# EAGLE design v2 (EAGLE 9.6.2)
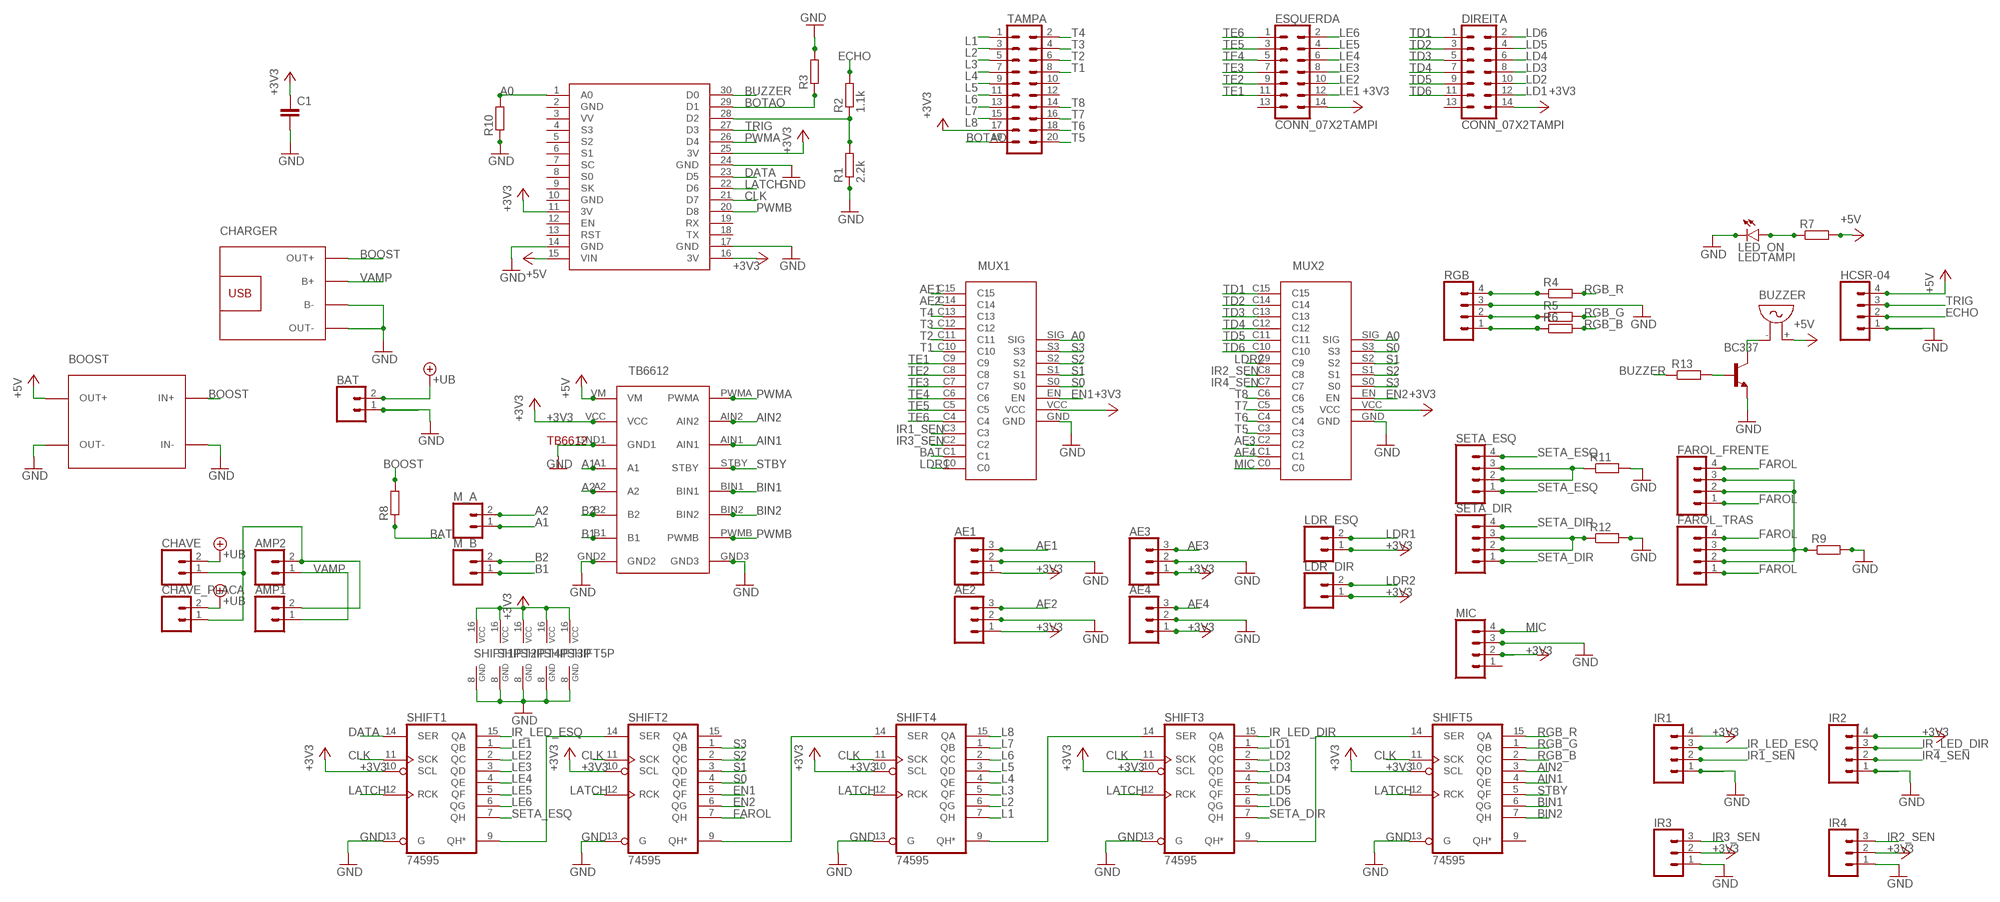
[diagram p0: schematic, sheet 1]

## Parts
AE1  CONN_03TAMPI  [TAMPI_1X03]
AE2  CONN_03TAMPI  [TAMPI_1X03]
AE3  CONN_03TAMPI  [TAMPI_1X03]
AE4  CONN_03TAMPI  [TAMPI_1X03]
AMP1  CONN_02TAMPI  [TAMPI_1X02]
AMP2  CONN_02TAMPI  [TAMPI_1X02]
BAT  CONN_02TAMPI  [TAMPI_1X02]
BC337  BC337  [TAMPI_BC337]
BOOST  MT3608TAMPI  [TAMPI_MT3608]
BUZZER  BUZZERTAMPI  [TAMPI_BUZZER]
C1  CAPACITORTAMPI  [TAMPI_C2.5-3]
CHARGER  TP4056TAMPI  [TAMPI_TP4056]
CHAVE  CONN_02TAMPI  [TAMPI_1X02]
CHAVE_PLACA  CONN_02TAMPI  [TAMPI_1X02]
DIREITA  CONN_07X2TAMPI  [TAMPI_2X7]
ESQUERDA  CONN_07X2TAMPI  [TAMPI_2X7]
FAROL_FRENTE  CONN_04  [TAMPI_1X04]
FAROL_TRAS  CONN_04  [TAMPI_1X04]
HCSR-04  CONN_04  [TAMPI_1X04]
IR1  CONN_04  [TAMPI_1X04]
IR2  CONN_04  [TAMPI_1X04]
IR3  CONN_03TAMPI  [TAMPI_1X03]
IR4  CONN_03TAMPI  [TAMPI_1X03]
LDR_DIR  CONN_02TAMPI  [TAMPI_1X02]
LDR_ESQ  CONN_02TAMPI  [TAMPI_1X02]
LED_ON  LEDTAMPI  [TAMPI_LED3MM]
M_A  CONN_02TAMPI  [TAMPI_1X02]
M_B  CONN_02TAMPI  [TAMPI_1X02]
MIC  CONN_04  [TAMPI_1X04]
MUX1  4067TAMPI  [TAMPI_4067]
MUX2  4067TAMPI  [TAMPI_4067]
R1  2.2k  RESISTOR  [TAMPI_RES]
R2  1.1k  RESISTOR  [TAMPI_RES]
R3  RESISTOR  [TAMPI_RES]
R4  RESISTOR  [TAMPI_RES]
R5  RESISTOR  [TAMPI_RES]
R6  RESISTOR  [TAMPI_RES]
R7  RESISTOR  [TAMPI_RES]
R8  RESISTOR  [TAMPI_RES]
R9  RESISTOR  [TAMPI_RES]
R10  RESISTOR  [TAMPI_RES]
R11  RESISTOR  [TAMPI_RES]
R12  RESISTOR  [TAMPI_RES]
R13  RESISTOR  [TAMPI_RES]
RGB  CONN_04  [TAMPI_1X04]
SETA_DIR  CONN_04  [TAMPI_1X04]
SETA_ESQ  CONN_04  [TAMPI_1X04]
SHIFT1  74595  [TAMPI_74595]
SHIFT2  74595  [TAMPI_74595]
SHIFT3  74595  [TAMPI_74595]
SHIFT4  74595  [TAMPI_74595]
SHIFT5  74595  [TAMPI_74595]
TAMPA  CONN_10X2TAMPI  [TAMPI_2X10]
TB6612  TB6612FNGTAMPI  [TAMPI_TB6612]
U$1  NODEMCUTAMPI  [TAMPI_NODEMCU]

## Nets
+3V3: AE1.1 AE2.1 AE3.1 AE4.1 C1.1 DIREITA.14 ESQUERDA.14 IR1.4 IR2.4 IR3.2 IR4.2 LDR_DIR.1 LDR_ESQ.1 MIC.2 MUX1.VCC MUX2.VCC SHIFT1.10(SCL) SHIFT1.16(VCC) SHIFT2.10(SCL) SHIFT2.16(VCC) SHIFT3.10(SCL) SHIFT3.16(VCC) SHIFT4.10(SCL) SHIFT4.16(VCC) SHIFT5.10(SCL) SHIFT5.16(VCC) TAMPA.17 TB6612.VCC U$1.11(3V) U$1.16(3V) U$1.25(3V)
+5V: BOOST.OUT+ BUZZER.+ HCSR-04.4 R7.2 TB6612.VM U$1.15(VIN)
+UB [bat power]: BAT.2 CHAVE.2 CHAVE_PLACA.2
A0: MUX1.SIG MUX2.SIG R10.2 U$1.1(A0)
A1: M_A.1 TB6612.A1
A2: M_A.2 TB6612.A2
AE1: AE1.3 MUX1.C15
AE2: AE2.3 MUX1.C14
AE3: AE3.3 MUX2.C2
AE4: AE4.3 MUX2.C1
AIN1: SHIFT5.4(QE) TB6612.AIN1
AIN2: SHIFT5.3(QD) TB6612.AIN2
B1: M_B.1 TB6612.B1
B2: M_B.2 TB6612.B2
BAT: MUX1.C1 R8.1
BIN1: SHIFT5.6(QG) TB6612.BIN1
BIN2: SHIFT5.7(QH) TB6612.BIN2
BOOST [bat power]: BOOST.IN+ CHARGER.OUT+ R8.2
BOTAO: R3.1 TAMPA.19 U$1.29(D1)
BUZZER: R13.1 U$1.30(D0)
CLK: SHIFT1.11(SCK) SHIFT2.11(SCK) SHIFT3.11(SCK) SHIFT4.11(SCK) SHIFT5.11(SCK) U$1.21(D7)
DATA: SHIFT1.14(SER) U$1.23(D5)
ECHO: HCSR-04.2 R2.2
EN1: MUX1.EN SHIFT2.5(QF)
EN2: MUX2.EN SHIFT2.6(QG)
FAROL: FAROL_FRENTE.1 FAROL_FRENTE.4 FAROL_TRAS.1 FAROL_TRAS.4 SHIFT2.7(QH)
GND: AE1.2 AE2.2 AE3.2 AE4.2 BAT.1 BC337.1(E) BOOST.IN- BOOST.OUT- C1.2 CHARGER.B- CHARGER.OUT- HCSR-04.1 IR1.1 IR2.1 IR3.1 IR4.1 LED_ON.K(C) MIC.3 MUX1.GND MUX2.GND R1.1 R3.2 R9.2 R10.1 R11.2 R12.2 RGB.3 SHIFT1.8(GND) SHIFT1.13(G) SHIFT2.8(GND) SHIFT2.13(G) SHIFT3.8(GND) SHIFT3.13(G) SHIFT4.8(GND) SHIFT4.13(G) SHIFT5.8(GND) SHIFT5.13(G) TB6612.GND1 TB6612.GND2 TB6612.GND3 U$1.14(GND) U$1.17(GND) U$1.24(GND)
IR1_SEN: IR1.2 MUX1.C3
IR2_SEN: IR4.3 MUX2.C8
IR3_SEN: IR3.3 MUX1.C2
IR4_SEN: IR2.2 MUX2.C7
IR_LED_DIR: IR2.3 SHIFT3.15(QA)
IR_LED_ESQ: IR1.3 SHIFT1.15(QA)
L1: SHIFT4.7(QH) TAMPA.1
L2: SHIFT4.6(QG) TAMPA.3
L3: SHIFT4.5(QF) TAMPA.5
L4: SHIFT4.4(QE) TAMPA.7
L5: SHIFT4.3(QD) TAMPA.9
L6: SHIFT4.2(QC) TAMPA.11
L7: SHIFT4.1(QB) TAMPA.13
L8: SHIFT4.15(QA) TAMPA.15
LATCH: SHIFT1.12(RCK) SHIFT2.12(RCK) SHIFT3.12(RCK) SHIFT4.12(RCK) SHIFT5.12(RCK) U$1.22(D6)
LD1: DIREITA.12 SHIFT3.1(QB)
LD2: DIREITA.10 SHIFT3.2(QC)
LD3: DIREITA.8 SHIFT3.3(QD)
LD4: DIREITA.6 SHIFT3.4(QE)
LD5: DIREITA.4 SHIFT3.5(QF)
LD6: DIREITA.2 SHIFT3.6(QG)
LDR1: LDR_ESQ.2 MUX1.C0
LDR2: LDR_DIR.2 MUX2.C9
LE1: ESQUERDA.12 SHIFT1.1(QB)
LE2: ESQUERDA.10 SHIFT1.2(QC)
LE3: ESQUERDA.8 SHIFT1.3(QD)
LE4: ESQUERDA.6 SHIFT1.4(QE)
LE5: ESQUERDA.4 SHIFT1.5(QF)
LE6: ESQUERDA.2 SHIFT1.6(QG)
MIC: MIC.4 MUX2.C0
N$1: R4.1 RGB.4
N$2: R5.1 RGB.2
N$3: R6.1 RGB.1
N$4: R11.1 SETA_ESQ.2 SETA_ESQ.3
N$5: SHIFT1.9(QH*) SHIFT2.14(SER)
N$6: FAROL_FRENTE.2 FAROL_FRENTE.3 FAROL_TRAS.2 FAROL_TRAS.3 R9.1
N$7: R12.1 SETA_DIR.2 SETA_DIR.3
N$8 [bat power]: AMP1.2 AMP2.2 CHAVE.1 CHAVE_PLACA.1
N$9: BC337.2(B) R13.2
N$10: BC337.3(C) BUZZER.-
N$28: LED_ON.A R7.1
N$29: SHIFT3.9(QH*) SHIFT5.14(SER)
N$30: SHIFT3.14(SER) SHIFT4.9(QH*)
N$31: SHIFT2.9(QH*) SHIFT4.14(SER)
N$39: R1.2 R2.1 U$1.28(D2)
PWMA: TB6612.PWMA U$1.26(D4)
PWMB: TB6612.PWMB U$1.20(D8)
RGB_B: R6.2 SHIFT5.2(QC)
RGB_G: R5.2 SHIFT5.1(QB)
RGB_R: R4.2 SHIFT5.15(QA)
S0: MUX1.S0 MUX2.S3 SHIFT2.4(QE)
S1: MUX1.S1 MUX2.S2 SHIFT2.3(QD)
S2: MUX1.S2 MUX2.S1 SHIFT2.2(QC)
S3: MUX1.S3 MUX2.S0 SHIFT2.1(QB)
SETA_DIR: SETA_DIR.1 SETA_DIR.4 SHIFT3.7(QH)
SETA_ESQ: SETA_ESQ.1 SETA_ESQ.4 SHIFT1.7(QH)
STBY: SHIFT5.5(QF) TB6612.STBY
T1: MUX1.C10 TAMPA.8
T2: MUX1.C11 TAMPA.6
T3: MUX1.C12 TAMPA.4
T4: MUX1.C13 TAMPA.2
T5: MUX2.C3 TAMPA.20
T6: MUX2.C4 TAMPA.18
T7: MUX2.C5 TAMPA.16
T8: MUX2.C6 TAMPA.14
TD1: DIREITA.1 MUX2.C15
TD2: DIREITA.3 MUX2.C14
TD3: DIREITA.5 MUX2.C13
TD4: DIREITA.7 MUX2.C12
TD5: DIREITA.9 MUX2.C11
TD6: DIREITA.11 MUX2.C10
TE1: ESQUERDA.11 MUX1.C9
TE2: ESQUERDA.9 MUX1.C8
TE3: ESQUERDA.7 MUX1.C7
TE4: ESQUERDA.5 MUX1.C6
TE5: ESQUERDA.3 MUX1.C5
TE6: ESQUERDA.1 MUX1.C4
TRIG: HCSR-04.3 U$1.27(D3)
VAMP [bat power]: AMP1.1 AMP2.1 CHARGER.B+
Unconnected: DIREITA.13 ESQUERDA.13 MIC.1 SHIFT2.15(QA) SHIFT5.9(QH*) TAMPA.10 TAMPA.12 U$1.3(VV) U$1.4(S3) U$1.5(S2) U$1.6(S1) U$1.7(SC) U$1.8(S0) U$1.9(SK) U$1.12(EN) U$1.13(RST) U$1.18(TX) U$1.19(RX)

## Power pins joined to a net without a drawn wire
GND: U$1.2(GND) U$1.10(GND)

## Library data of the parts
AE1-AE4 IR3 IR4 = tampi:CONN_03: Multi connection point. Often used as Generic Header-pin footprint for 0.1 inch spaced/style header connections On any of the 0.1 inch spaced packages, you can populate with these: Break Away Headers - Straight <https://www.sparkfun.com/products/116> (PRT-00116) Break Away Male Headers - Right Angle <https://www.sparkfun.com/products/553> (PRT-00553) Female Headers <https://www.sparkfun.com/products/115> (PRT-00115) Break Away Headers - Machine Pin <https://www.sparkfun.com/products/117> (PRT-00117) Break Away Female Headers - Swiss Machine Pin <https://www.sparkfun.com/products/743> (PRT-00743) Stackable Header - 3 Pin (Female, 0.1") <https://www.sparkfun.com/products/13875> (PRT-13875) For SCREWTERMINALS and SPRING TERMINALS visit here: Screw Terimnals on SparkFun.com <https://www.sparkfun.com/search/results?term=Screw+Terminals> (5mm/3.5mm/2.54mm spacing) This device is also useful as a general connection point to wire up your design to another part of your project. Our various solder wires solder well into these plated through hole pads. Hook-Up Wire - Assortment (Stranded, 22 AWG) <https://www.sparkfun.com/products/11375> (PRT-11375) Hook-Up Wire - Assortment (Solid Core, 22 AWG) <https://www.sparkfun.com/products/11367> (PRT-11367) View the entire wire category on our website here <https://www.sparkfun.com/categories/141> Special notes: Molex polarized connector foot print use with SKU : PRT-08232 with associated crimp pins and housings.
AMP1 AMP2 BAT CHAVE CHAVE_PLACA LDR_DIR LDR_ESQ M_A M_B = tampi:CONN_02: Multi connection point. Often used as Generic Header-pin footprint for 0.1 inch spaced/style header connections On any of the 0.1 inch spaced packages, you can populate with these: Break Away Headers - Straight <https://www.sparkfun.com/products/116> (PRT-00116) Break Away Male Headers - Right Angle <https://www.sparkfun.com/products/553> (PRT-00553) Female Headers <https://www.sparkfun.com/products/115> (PRT-00115) Break Away Headers - Machine Pin <https://www.sparkfun.com/products/117> (PRT-00117) Break Away Female Headers - Swiss Machine Pin <https://www.sparkfun.com/products/743> (PRT-00743) For SCREWTERMINALS and SPRING TERMINALS visit here: Screw Terimnals on SparkFun.com <https://www.sparkfun.com/search/results?term=Screw+Terminals> (5mm/3.5mm/2.54mm spacing) This device is also useful as a general connection point to wire up your design to another part of your project. Our various solder wires solder well into these plated through hole pads. Hook-Up Wire - Assortment (Stranded, 22 AWG) <https://www.sparkfun.com/products/11375> (PRT-11375) Hook-Up Wire - Assortment (Solid Core, 22 AWG) <https://www.sparkfun.com/products/11367> (PRT-11367) View the entire wire category on our website here <https://www.sparkfun.com/categories/141> Special notes: Molex polarized connector foot print use with: PRT-08233 with associated crimp pins and housings. 2.54_SCREWTERM for use with PRT-10571. 3.5mm Screw Terminal footprints for PRT-08084 5mm Screw Terminal footprints for use with PRT-08432
BC337 = tampi:BC337: NPN Transistor
BOOST = tampi:MT3608: DC/DC Step-Up Regulator based on MT3608 chip MT3608 datasheet available here: https://www.olimex.com/Products/Breadboarding/BB-PWR-3608/resources/MT3608.pdf Click here to find device on ebay.com <http://www.ebay.com/sch/mt3608+module>
BUZZER = tampi:BUZZER: BUZZER Source: Buerklin; OC_FARNELL: unknown; OC_NEWARK: unknown
C1 = tampi:CAPACITOR: CAPACITOR naming: grid - package width
CHARGER = tampi:TP4056: Lithium Battery 5V Charger with protection circuit More details available here: http://www.instructables.com/id/DIY-Lithium-ion-Battery-Charger/step4/TP4056-based-lithium-ion-battery-charger-module/ Click here to find device on ebay.com <http://www.ebay.com/sch/tp4056+charger+usb+protection>
DIREITA ESQUERDA = tampi:CONN_07X2
FAROL_FRENTE FAROL_TRAS HCSR-04 IR1 IR2 MIC RGB SETA_DIR SETA_ESQ = tampi:CONN_04: Multi connection point. Often used as Generic Header-pin footprint for 0.1 inch spaced/style header connections On any of the 0.1 inch spaced packages, you can populate with these: Break Away Headers - Straight <https://www.sparkfun.com/products/116> (PRT-00116) Break Away Male Headers - Right Angle <https://www.sparkfun.com/products/553> (PRT-00553) Female Headers <https://www.sparkfun.com/products/115> (PRT-00115) Break Away Headers - Machine Pin <https://www.sparkfun.com/products/117> (PRT-00117) Break Away Female Headers - Swiss Machine Pin <https://www.sparkfun.com/products/743> (PRT-00743) For SCREWTERMINALS and SPRING TERMINALS visit here: Screw Terimnals on SparkFun.com <https://www.sparkfun.com/search/results?term=Screw+Terminals> (5mm/3.5mm/2.54mm spacing) This device is also useful as a general connection point to wire up your design to another part of your project. Our various solder wires solder well into these plated through hole pads. Hook-Up Wire - Assortment (Stranded, 22 AWG) <https://www.sparkfun.com/products/11375> (PRT-11375) Hook-Up Wire - Assortment (Solid Core, 22 AWG) <https://www.sparkfun.com/products/11367> (PRT-11367) View the entire wire category on our website here <https://www.sparkfun.com/categories/141> Special notes: Molex polarized connector foot print use with SKU : PRT-08231 with associated crimp pins and housings. 1MM SMD Version SKU: PRT-10208
LED_ON = tampi:LED: Low Current (2mA) LED 3 mm Tinted Diffused Package color RED Source: Data sheet <http://www.farnell.com/datasheets/391100.pdf>
MUX1 MUX2 = tampi:4067
R1-R13 = tampi:RESISTOR: RESISTOR, European symbol
SHIFT1-SHIFT5 = tampi:74595: 8-bit SHIFT REGISTER, output latch
TAMPA = tampi:CONN_10X2: Multi connection point. Often used as Generic Header-pin footprint for 0.1 inch spaced/style header connections On any of the 0.1 inch spaced packages, you can populate with these: Break Away Headers - Straight <https://www.sparkfun.com/products/116> (PRT-00116) Break Away Male Headers - Right Angle <https://www.sparkfun.com/products/553> (PRT-00553) Female Headers <https://www.sparkfun.com/products/115> (PRT-00115) Break Away Headers - Machine Pin <https://www.sparkfun.com/products/117> (PRT-00117) Break Away Female Headers - Swiss Machine Pin <https://www.sparkfun.com/products/743> (PRT-00743) Special note about the "SPECIAL" package: This was SPECIALLY designed to be used with our Graphic LCD Backpack. Be sure you want to use this! It is not only staggered on each line of header holes, but IT IS ALSO offset of the center point of the top and bottom lines by 5 mil. This causes the headers to lock into place on the "standard" footprint on the LCD screen. The extra squares on the tdocu layer are there simply to reference other pins (if you were to actually populate a longer header than ten long - this is what we do with the backpacks).
TB6612 = tampi:TB6612FNG
U$1 = tampi:NODEMCU

## Net classes
0 default: width 0.25 mm
1 bat power: width 0.8 mm, drill 0.8 mm
2 esp power: width 0.3 mm, drill 0.3 mm

## Board
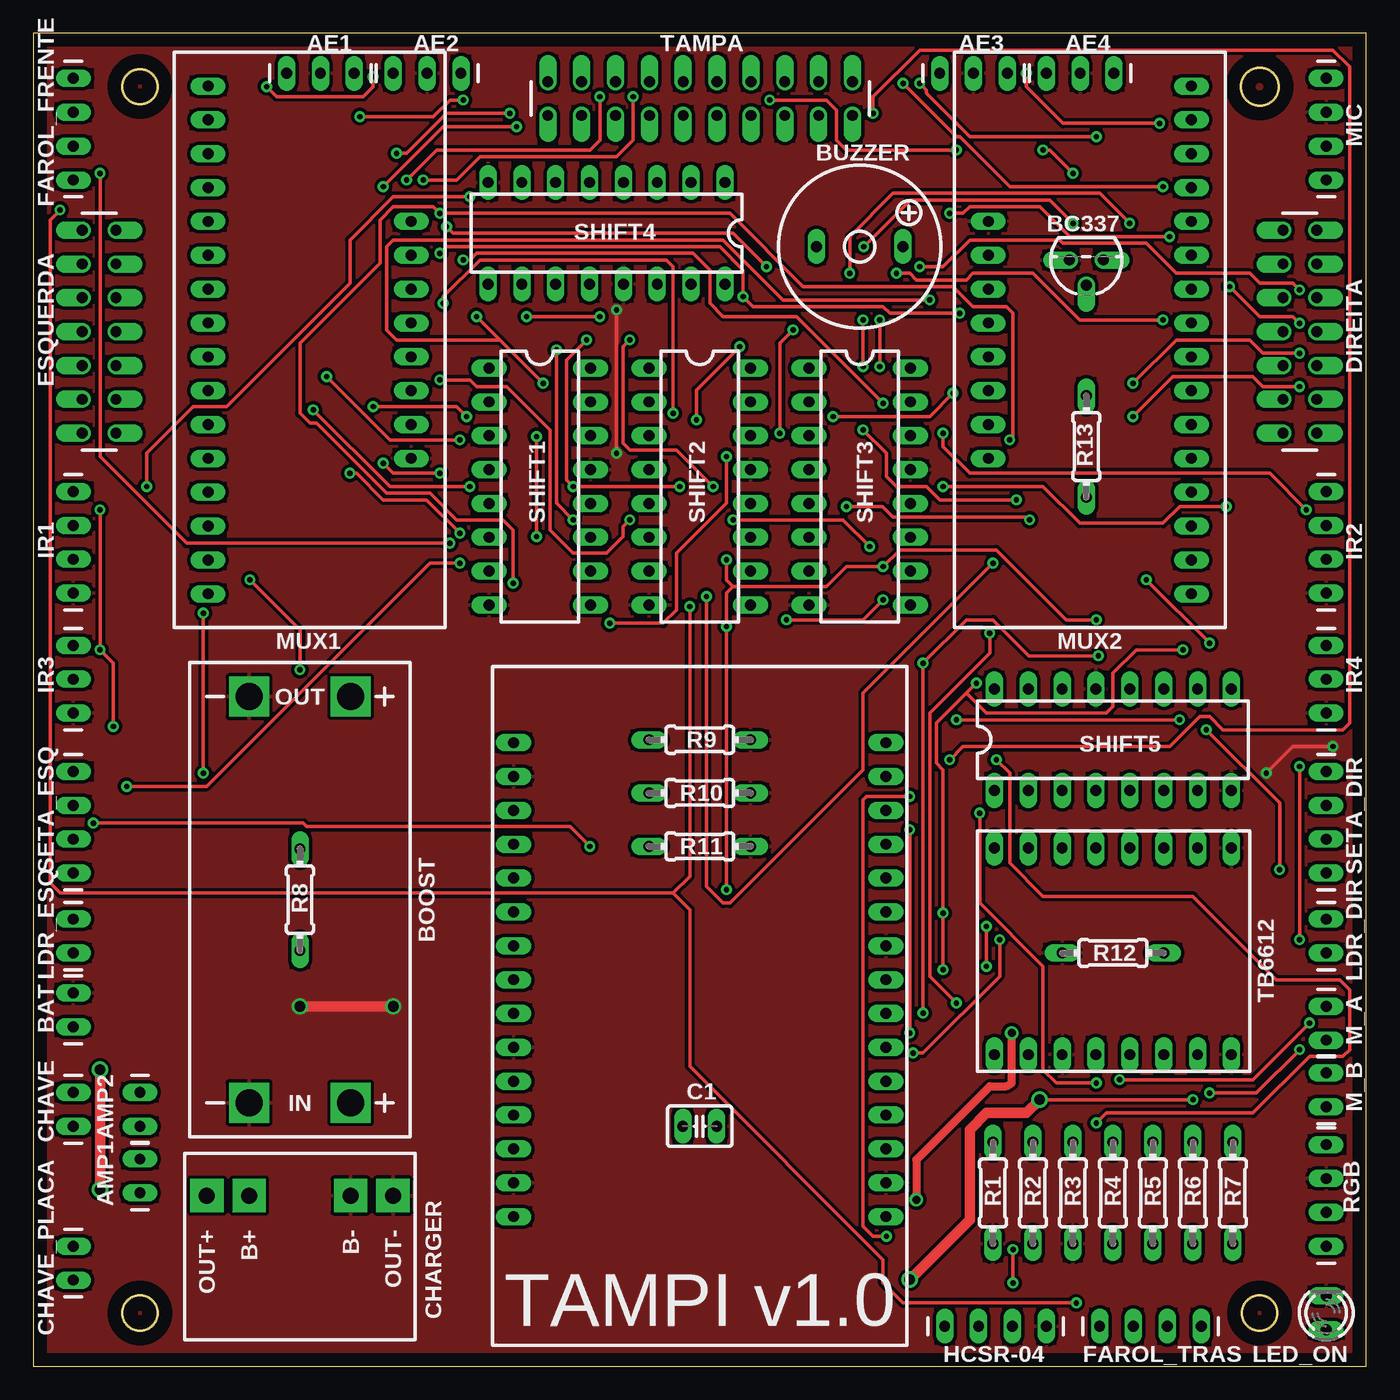
[diagram p1: board, top side]
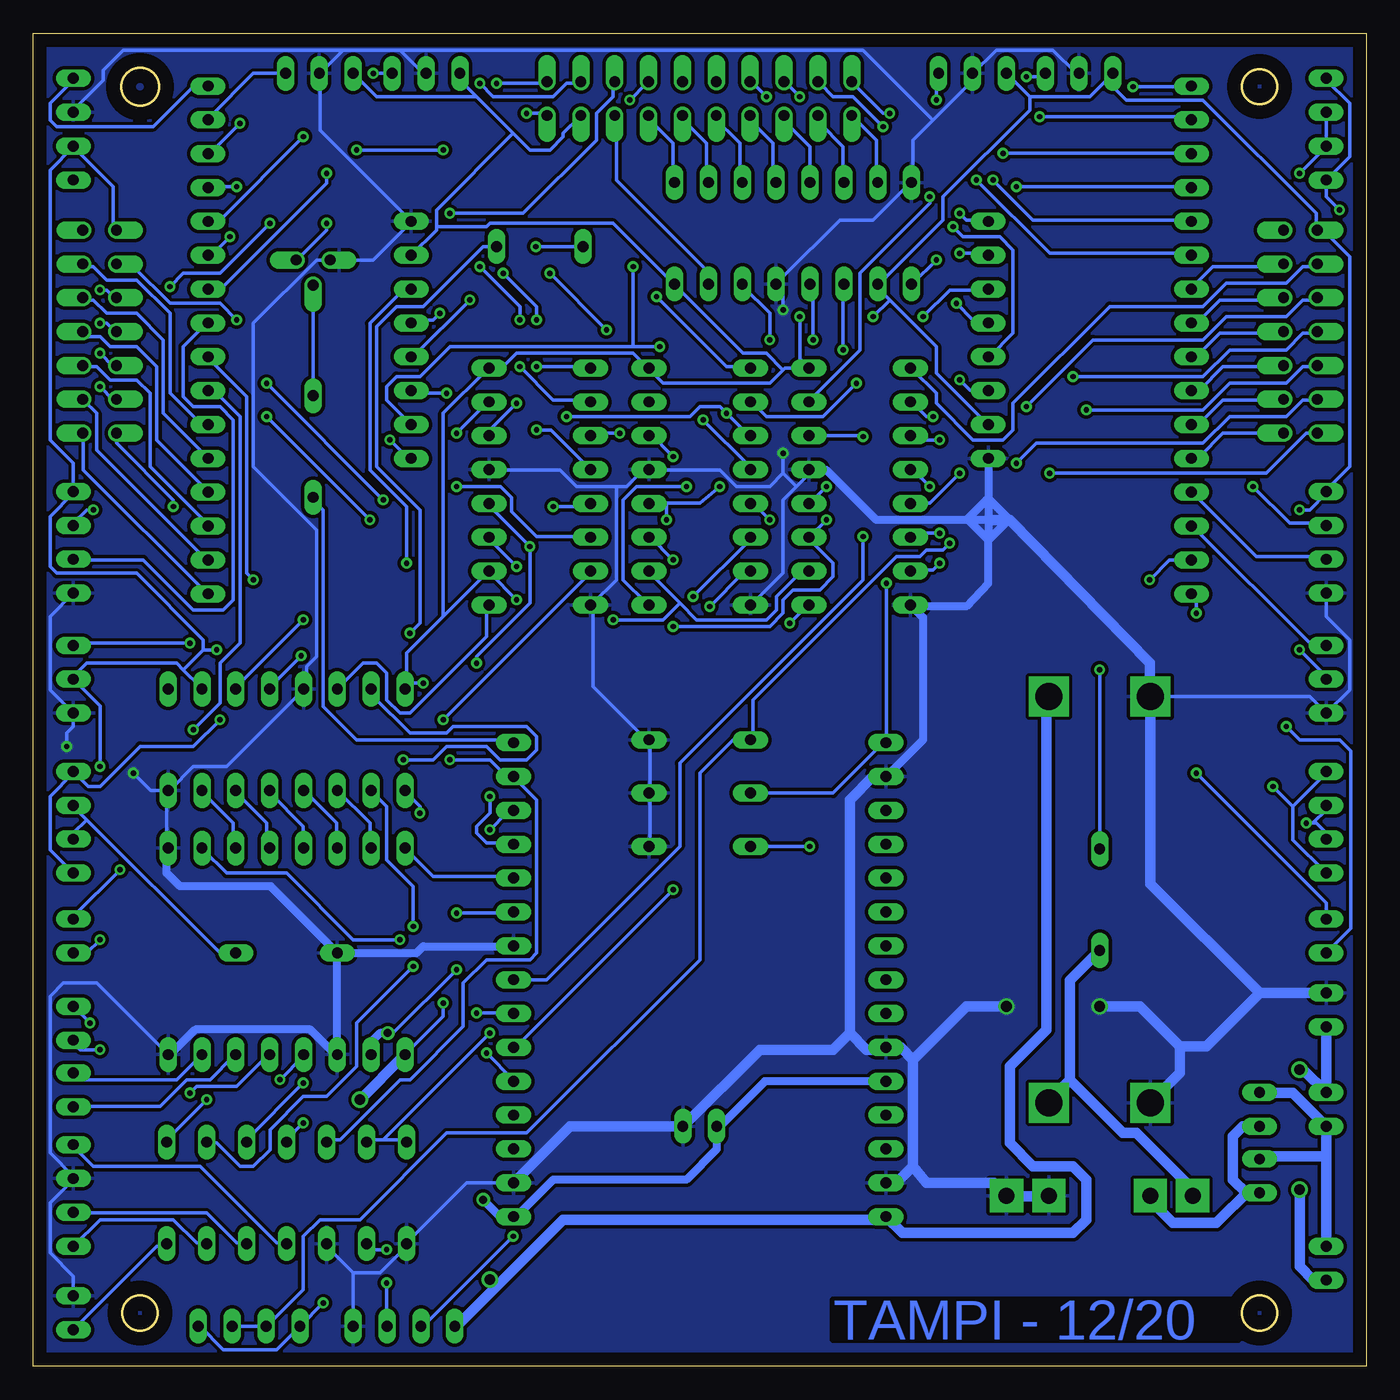
[diagram p2: board, bottom side, seen from below]

Size 100 x 100 mm. Coordinates in mm from the lower left corner, seen from the top.
Outline: 0,0 100,0 100,100 0,100 0,0
Outline: circle at 8,96 radius 1.3
Outline: circle at 92,96 radius 1.4
Outline: circle at 92,4 radius 1.3
Outline: circle at 8,4 radius 1.3
Copper layers (1*16): Top 0.035mm / dielectric 1.5mm / Bottom 0.035mm
Design rules "default *": minimum track width 0.25mm, minimum drill 0.4mm, track to track 0.25mm, track to pad 0.25mm, pad to pad 0.25mm, via to via 0.25mm, smd to smd 6mil, copper to edge 40mil, drill to drill 6mil, minimum pad ring 10mil, minimum via ring 8mil, stop-mask expansion 4mil, vias tented up to drill 0mil, thermal gap 10mil

### Footprints (pad centres in the part's own frame; a part is rotated, then mirrored left to right if it is on the bottom)
TAMPI_1X03 = drill 0.813 long: 1 0,0; 2 2.54,0; 3 5.08,0
TAMPI_1X02 = drill 0.813 long: 1 0,0; 2 2.54,0
TAMPI_BC337 = drill 0.813 offset: 1 1.27,0; 2 0,1.905; 3 -1.27,0
TAMPI_MT3608 = drill 2 pad 2.8 square: IN+ 15.24,3.81; IN- 15.24,-3.81; OUT+ -15.24,3.81; OUT- -15.24,-3.81
TAMPI_BUZZER = drill 0.813 long: + 3.251,0; - -3.251,0
TAMPI_C2.5-3 = drill 0.813 long: 1 -1.27,0; 2 1.27,0
TAMPI_TP4056 = drill 1.2 pad 2.5 square: B+ 10.795,3.81; B- 10.795,-3.81; OUT+ 10.795,6.985; OUT- 10.795,-6.985
TAMPI_2X7 = drill 0.813 offset: 1 0,0; 2 0,2.54; 3 2.54,0; 4 2.54,2.54; 5 5.08,0; 6 5.08,2.54; 7 7.62,0; 8 7.62,2.54; 9 10.16,0; 10 10.16,2.54; 11 12.7,0; 12 12.7,2.54; 13 15.24,0; 14 15.24,2.54
TAMPI_1X04 = drill 0.813 long: 1 0,0; 2 2.54,0; 3 5.08,0; 4 7.62,0
TAMPI_LED3MM = drill 0.813 long: A -1.27,0; K 1.27,0
TAMPI_4067 = drill 0.813 long: C0 -8.89,-19.05; C1 -8.89,-16.51; C2 -8.89,-13.97; C3 -8.89,-11.43; C4 -8.89,-8.89; C5 -8.89,-6.35; C6 -8.89,-3.81; C7 -8.89,-1.27; C8 -8.89,1.27; C9 -8.89,3.81; C10 -8.89,6.35; C11 -8.89,8.89; C12 -8.89,11.43; C13 -8.89,13.97; C14 -8.89,16.51; C15 -8.89,19.05; EN 6.35,-3.81; GND 6.35,-8.89; S0 6.35,-1.27; S1 6.35,1.27; S2 6.35,3.81; S3 6.35,6.35; SIG 6.35,8.89; VCC 6.35,-6.35
TAMPI_RES = drill 0.813 long: 1 -3.81,0; 2 3.81,0
TAMPI_74595 = drill 0.813 long: 1 -8.89,-3.81; 2 -6.35,-3.81; 3 -3.81,-3.81; 4 -1.27,-3.81; 5 1.27,-3.81; 6 3.81,-3.81; 7 6.35,-3.81; 8 8.89,-3.81; 9 8.89,3.81; 10 6.35,3.81; 11 3.81,3.81; 12 1.27,3.81; 13 -1.27,3.81; 14 -3.81,3.81; 15 -6.35,3.81; 16 -8.89,3.81
TAMPI_2X10 = drill 0.813 offset: 1 0,0; 2 0,2.54; 3 2.54,0; 4 2.54,2.54; 5 5.08,0; 6 5.08,2.54; 7 7.62,0; 8 7.62,2.54; 9 10.16,0; 10 10.16,2.54; 11 12.7,0; 12 12.7,2.54; 13 15.24,0; 14 15.24,2.54; 15 17.78,0; 16 17.78,2.54; 17 20.32,0; 18 20.32,2.54; 19 22.86,0; 20 22.86,2.54
TAMPI_TB6612 = drill 0.813 long: A1 -7.62,1.27; A2 -7.62,-1.27; AIN1 7.874,3.81; AIN2 7.874,6.35; B1 -7.62,-6.35; B2 -7.62,-3.81; BIN1 7.874,-1.27; BIN2 7.874,-3.81; GND1 -7.62,3.81; GND2 -7.62,-8.89; GND3 7.874,-8.89; PWMA 7.874,8.89; PWMB 7.874,-6.35; STBY 7.874,1.27; VCC -7.62,6.35; VM -7.62,8.89
TAMPI_NODEMCU = drill 0.813 long: 1 -13.97,17.78; 2 -13.97,15.24; 3 -13.97,12.7; 4 -13.97,10.16; 5 -13.97,7.62; 6 -13.97,5.08; 7 -13.97,2.54; 8 -13.97,0; 9 -13.97,-2.54; 10 -13.97,-5.08; 11 -13.97,-7.62; 12 -13.97,-10.16; 13 -13.97,-12.7; 14 -13.97,-15.24; 15 -13.97,-17.78; 16 13.97,-17.78; 17 13.97,-15.24; 18 13.97,-12.7; 19 13.97,-10.16; 20 13.97,-7.62; 21 13.97,-5.08; 22 13.97,-2.54; 23 13.97,0; 24 13.97,2.54; 25 13.97,5.08; 26 13.97,7.62; 27 13.97,10.16; 28 13.97,12.7; 29 13.97,15.24; 30 13.97,17.78

### Placement (x,y rotation side)
AE1  19,97 0 top
AE2  27,97 0 top
AE3  68,97 0 top
AE4  76,97 0 top
AMP1  8,13 90 top
AMP2  8,18 90 top
BAT  3,28 270 top
BC337  79,83 180 top
BOOST  20,35 270 top
BUZZER  62,84 0 top
C1  50,18 0 top
CHARGER  20,2 90 top
CHAVE  3,18 90 top
CHAVE_PLACA  3,9 270 top
DIREITA  96.3,70 90 top
ESQUERDA  6.2,70 90 top
FAROL_FRENTE  3,89 90 top
FAROL_TRAS  80,3 0 top
HCSR-04  76,3 180 top
IR1  3,58 90 top
IR2  97,58 90 top
IR3  3,49 90 top
IR4  97,49 90 top
LDR_DIR  97,31 90 top
LDR_ESQ  3,31 90 top
LED_ON  97,4 90 top
M_A  97,27 270 top
M_B  97,22 270 top
MIC  97,89 90 top
MUX1  22,77 0 top
MUX2  78,77 180 top
R1  72,13 90 top
R2  75,13 270 top
R3  78,13 270 top
R4  81,13 90 top
R5  84,13 90 top
R6  87,13 90 top
R7  90,13 90 top
R8  20,35 270 top
R9  50,47 0 top
R10  50,43 180 top
R11  50,39 0 top
R12  81,31 180 top
R13  79,69 90 top
RGB  97,9 90 top
SETA_DIR  97,37 90 top
SETA_ESQ  3,37 90 top
SHIFT1  38,66 270 top
SHIFT2  50,66 270 top
SHIFT3  62,66 270 top
SHIFT4  43,85 180 top
SHIFT5  81,47 0 top
TAMPA  38.6,93.84 0 top
TB6612  81,31 90 top
U$1  50,29 0 top

### Tracks (layer width: path | path; a pad name or v marks a point on that pad's centre or on a via)
+3V3  (via drill 0.4, 0.6)
  Top 0.25: v5,64.25 v5,53.75 6,52.75 v6,48 | v68.25,29.75 v68.25,34 68.25,44.75 67.75,45.25 67.75,48.25 70,50.5 | v56.5,56 62.25,56 v63.75,57.5 | v70.75,51.25 70,50.5 | v86.25,53.75 82.75,53.75 81,52 81,49.5 80.5,49 71.5,49 70,50.5 | v42.5,78.75 v37,78.75 | v95,32 v95,45
  Top 0.6: v66.25,12.5 66.25,15.5 71.75,21 73,21 73.4,21.25 v73.4,25
  Bottom 0.25: v5,53.75 3,51.75 IR3.2 | v5,64.25 4.25,64.25 3,65.5 IR1.4 3,65.75 1.25,67.5 1.25,83.25 3,85 3.5,85 ESQUERDA.14 3.75,85.25 3.75,86.5 12.25,95 18,95 19.5,96.5 | 19.5,96.5 20.75,95.25 25.25,95.25 | AE2.1 25.25,95.25 | 35.75,80 36.75,81 SHIFT4.10 36.5,81.25 31.75,86 31.75,87.75 25.25,94.25 25.25,95.25 | 35.75,80 32.25,76.5 32.25,74.5 28.5,70.75 MUX1.VCC | 19.5,96.5 AE1.1 | 88.75,52.25 89.25,52.75 96,52.75 97,51.75 IR4.2 95,49.54 v95,45 | 88.75,52.25 87.5,51 SHIFT5.10 | 97,91.5 94,88.5 94,85.25 DIREITA.14 | 97,91.5 98.75,89.75 98.75,69.5 97,67.75 IR2.4 97,65.5 98.75,63.75 98.75,60 98.25,59.5 92.25,59.5 87.25,54.5 87.25,53.75 | 97,91.5 MIC.2 | 87.25,53.75 88.75,52.25 | 48.5,18 C1.1 48.75,18 | 63.75,11.25 U$1.16 | 66.75,95.25 68,96.5 AE3.1 | 66.75,95.25 64,92.5 | 64,92.5 62.75,91.25 61.25,91.25 60.25,92.25 60.25,92.5 59,93.75 TAMPA.17 | MUX2.VCC 69.75,85.25 69.75,85.5 | 69.75,85.5 69.75,86.75 64,92.5 | AE4.1 74.25,95.25 66.75,95.25 | 43.75,74.75 44.75,73.75 52.75,73.75 53.75,74.75 SHIFT2.16 54,75 55,76 63.75,76 64.75,75 65.75,75 SHIFT3.16 66,74.75 69.25,71.5 69.25,56.25 | 43.75,74.75 45,76 46.75,76 51.75,81 SHIFT4.16 52,81.25 56.5,85.75 65.75,85.75 66,85.5 69.75,85.5 | v68.25,34 64,34 U$1.25 | v73.4,25 73,25 v68.25,29.75 | 51.5,57.25 53.75,59.5 SHIFT2.10 | 51.5,57.25 50.25,56 45,56 44.25,56.75 44.25,57.75 42.5,59.5 42,59.5 SHIFT1.10 | 72,51.25 72,53.5 69.25,56.25 | 72,51.25 72,51 SHIFT5.16 72,51.25 | 69.25,56.25 66,59.5 SHIFT3.10 65.75,59.5 v63.75,57.5 | 51.5,57.25 52.75,56 v56.5,56 | 72,51.25 v70.75,51.25 | v86.25,53.75 87.25,53.75 | v37,78.75 35.75,80 | v42.5,78.75 42.5,75.58 SHIFT1.16 43.61,74.89 43.75,74.75
  Bottom 0.25: v6,48 5,47 2,47 1.14,46.14 1.14,32.86 LDR_ESQ.1 | LDR_DIR.1 96,31 v95,32
  Bottom 0.6: U$1.11 45.12,21.38 48.5,18 | TB6612.VCC 74.65,24.35 74,25 v73.4,25 | v66.25,12.5 64.97,11.22 U$1.16 | C1.1 48.73,16.27 51,14 61,14 63.75,11.25
+5V  (via drill 0.4, 0.8)
  Top 0.25: v87,20 v75.5,20 | v71.75,55 71.75,53.5 67.25,49 67.25,29.25 v69.25,27.25
  Top 0.8: v75.5,20 74.5,19 71.5,19 70.25,17.75 70.25,11 v65.75,6.5
  Bottom 0.25: v87,20 90,17 R7.2 | 72.25,23.25 TB6612.VM 72,23.5 69.25,26.25 v69.25,27.25 | BUZZER.+ 66.25,84 70.75,79.5 72.75,79.5 74.25,78 74.25,67.5 71,64.25 71,55.75 v71.75,55 | 36.25,11 U$1.15 36,11 | 68.25,3 HCSR-04.4 | 24,50 BOOST.OUT+
  Bottom 0.8: v75.5,20 72.25,23.25 | 36.25,11 60.25,11 65.25,6 | 68.25,3 65.25,6 | 24,50 24,25.25 26.75,22.5 26.75,16.75 25,15 22,15 21,14 21,11 22,10 34.81,10 U$1.15 | 65.25,6 v65.75,6.5
+UB  (via drill 0.8)
  Top 0.8: v5,22.25 v5,13.25
  Bottom 0.8: v5,13.25 5,7.5 3.96,6.46 CHAVE_PLACA.2 | v5,22.25 4.71,22.25 CHAVE.2 BAT.2
A0  (via drill 0.4)
  Top 0.25: v73.25,69.5 73.5,69.75 73.5,79 73,79.5 70.5,79.5 69,81 57.75,81 52.25,86.5 v30.5,86.5 30,87 27,87 26,86 26,82.75 20,76.75 20,71.5 20.75,70.75 21.25,70.75 26.5,65.5 29.75,65.5 31.75,63.5 35.25,63.5 36,62.75 v36,58.75
  Bottom 0.25: R10.2 40,43 36.25,46.75 U$1.1 36,47 v36,58.75 | v30.5,86.5 30,86 28.5,86 MUX1.SIG | v73.25,69.5 71.75,68 MUX2.SIG
A1  (via drill 0.4)
  Top 0.25: v81.5,21.5 91.5,21.5 v95.75,25.75
  Bottom 0.25: v81.5,21.5 79.75,23.25 TB6612.A1 | M_A.1 v95.75,25.75
A2  (via drill 0.4)
  Top 0.25: v88.25,20.5 91.75,20.5 v95,23.75
  Bottom 0.25: v88.25,20.5 87.75,21 84.75,21 82.5,23.25 TB6612.A2 | v95,23.75 96.5,23.75 97,24.25 M_A.2
AE1  (via drill 0.4)
  Top 0.25: v17.5,96 18.25,95.25 24.75,95.25 25.5,96 v25.5,96.75
  Bottom 0.25: v17.5,96 13.25,96 MUX1.C15 | v25.5,96.75 24.5,96.75 24.25,97 AE1.3
AE2  (via drill 0.4)
  Top 0.25: v24.5,93.75 30,93.75 31.25,95 v32.25,95
  Bottom 0.25: v24.5,93.75 13.25,93.75 MUX1.C14 | v32.25,95 32.25,97 AE2.3
AE3  (via drill 0.4)
  Top 0.25: v74.5,97 74.5,96 77.25,93.25 v84.5,93.25
  Bottom 0.25: v74.5,97 AE3.3 | v84.5,93.25 86.75,91 MUX2.C2
AE4
  Bottom 0.25: AE4.3 83.5,97 86.75,93.75 MUX2.C1
AIN1
  Bottom 0.25: TB6612.AIN1 77.25,39 77.25,40.75 79.5,43 SHIFT5.4
AIN2
  Bottom 0.25: SHIFT5.3 74.75,40.75 74.75,39 TB6612.AIN2
B1
  Bottom 0.25: M_B.1 96.5,21.5 89.25,21.5 87.5,23.25 TB6612.B1
B2
  Bottom 0.25: TB6612.B2 85,23.25 86.75,21.5 88.5,21.5 90.5,19.5 97,19.5 M_B.2
BAT  (via drill 0.4)
  Top 0.25: v16.25,59 20,55.25 v20,52.25
  Bottom 0.25: v20,52.25 R8.1 | v16.25,59 14.76,60.49 MUX1.C1
BIN1
  Bottom 0.25: TB6612.BIN1 82.5,39 82.5,40.75 84.75,43 SHIFT5.6
BIN2
  Bottom 0.25: TB6612.BIN2 85,39 85,40.75 87.25,43 SHIFT5.7
BOOST
  Bottom 0.8: 22.25,21.5 23.75,20 BOOST.IN+ | 22.25,21.5 18.25,17.5 17.25,17.5 13.25,13.5 13.25,13 CHARGER.OUT+ | R8.2 22.25,28.94 22.25,21.5
BOTAO  (via drill 0.4)
  Top 0.25: v63,94 63,95.25 66.5,98.75 97.5,98.75 98.75,97.5 98.75,48.25 98.25,47.75 89.25,47.75 88.25,48.75 87.5,48.75 85.25,46.5 69.75,46.5 v68.75,45.5
  Bottom 0.25: R3.1 78,17 77,17 72.5,21.5 71.75,21.5 67.75,25.5 67.75,28.75 66,30.5 62.75,30.5 62.25,31 62.25,42.5 63.75,44 U$1.29 64,44.25 64.5,44.25 65.75,45.5 v68.75,45.5 | v63,94 61.5,94 TAMPA.19
BUZZER
  Bottom 0.25: U$1.30 64,47 75.75,47 78.25,49.5 78.25,64.25 79,65 R13.1
CLK  (via drill 0.4)
  Top 0.25: v52,60.5 52,59 52.5,58.5 | v52,35.75 v52,55.5 52,58 52.5,58.5 | 52.5,58.5 59.5,58.5 61,60 v63.75,60 65,61.25 72.25,61.25 77.5,56 v79.75,56 | v39.25,76.25 39.25,64.75 v40.5,63.5
  Bottom 0.25: v52,35.75 63.75,24 U$1.21 | v52,60.5 53.75,62.25 SHIFT2.11 | v52,55.5 44.75,55.5 43.75,56.5 43.75,57.5 43,58.25 41,58.25 40,59.25 40,60.25 41.75,62 SHIFT1.11 v40.5,63.5 | v63.75,60 65.75,62 SHIFT3.11 | v79.75,56 84.75,51 SHIFT5.11 | v39.25,76.25 39.25,81 SHIFT4.11
DATA  (via drill 0.4)
  Top 0.25: v37.75,69.75 v37.75,62.25
  Bottom 0.25: U$1.23 61.5,29 51.5,39 51.5,45.25 37.75,59 v37.75,62.25 | SHIFT1.14 37.81,69.81 v37.75,69.75
ECHO  (via drill 0.4)
  Top 0.25: v73.5,8.75 v73.5,6.25
  Bottom 0.25: v73.5,6.25 73.5,3 HCSR-04.2 | v73.5,8.75 74.75,8.75 75,9 R2.2
EN1  (via drill 0.4)
  Top 0.25: v30.5,74 32.75,74 33.25,73.5 35.5,73.5 38.75,70.25 38.75,62.75 40.5,61 43,61 44.25,62.25 44.25,63 v44.75,63.5
  Bottom 0.25: v30.5,74 29.75,73.25 28.5,73.25 MUX1.EN | v44.75,63.5 46,64.75 SHIFT2.5
EN2  (via drill 0.4)
  Top 0.25: v50.5,57.75 50.5,36 51.75,34.75 52.25,34.75 62.25,44.75 62.25,50.5 v72,60.25
  Bottom 0.25: v50.5,57.75 46.25,62 SHIFT2.6 | v72,60.25 72,64.5 74.75,67.25 74.75,78.25 72.25,80.75 71.75,80.75 MUX2.EN
FAROL  (via drill 0.4)
  Top 0.25: v49.25,57 49.25,36.75 48,35.5 | v78.25,4.75 65.25,4.75 63.75,6.25 63.75,8 49.25,22.5 49.25,34.25 48,35.5 | v2,86.75 1.25,86 1.25,36.25 2,35.5 48,35.5
  Bottom 0.25: FAROL_FRENTE.4 3,96.5 1.25,94.75 1.25,90.75 FAROL_FRENTE.1 3,87.75 v2,86.75 | FAROL_TRAS.4 87.5,3 85.75,1.25 81.75,1.25 FAROL_TRAS.1 v78.25,4.75 | v49.25,57 46.75,59.5 46.25,59.5 SHIFT2.7
GND  (via drill 0.4, 0.8)
  Top 0.25: v92.5,44.5 94.5,46.5 v97.5,46.5 | v43.75,79.25 v43.75,68.5
  Top 0.8: v20,27 v27,27
  Bottom 0.25: 36,13.75 U$1.14 | 27,13 CHARGER.OUT- 26.75,12.75 | 36,23.75 U$1.10 36.25,23.75 | 24,12.75 CHARGER.B- | 76,7 HCSR-04.1 | 76,7 78,9 R3.2 | 63.75,14 U$1.17 64,13.75 67.5,13.75 72,9.25 R1.1 72,9 74,7 76,7 | 51.25,18 C1.2 | 53.75,43 53.75,39 R11.2 | 53.75,43 53.75,47 R9.2 54,47 58,51 58,57 SHIFT3.8 58,57.25 56.25,59 56.25,66 | 53.75,43 R10.1 | 42.75,66 43.75,65 43.75,59.5 46,57.25 SHIFT2.8 | 42.75,66 42,66.75 42,67.25 SHIFT1.13 41.75,67.25 | 56.25,66 55.5,66 54,67.5 SHIFT2.13 53.75,67.25 48.5,67.25 47.25,66 44.75,66 43.75,67 | 56.25,66 59.25,66 60.5,67.25 65.75,67.25 SHIFT3.13 | 16,20 BOOST.IN- | IR1.1 3,56.25 1.25,54.5 1.25,50.75 IR3.1 4.24,50.24 BOOST.OUT- 16.25,50.25 | 28.5,68 MUX1.GND | 34,57 SHIFT1.8 34.25,57 | 36,44.25 U$1.2 | IR2.1 98.75,56.25 98.75,50.75 IR4.1 97,48 97.5,47.5 v97.5,46.5 | SHIFT5.8 90,43 90,39 TB6612.GND3 89.75,38.75 | SHIFT5.8 89.75,43.25 88,45 85.5,45 79.75,50.75 SHIFT5.13 79.5,51 79.5,52.5 78.75,53.25 78.75,62.75 83.5,67.5 83.5,78.25 78.75,83 BC337.1 74.5,83 71.75,85.75 MUX2.GND 71.75,86 78.5,92.75 78.5,97 | 64,31.5 U$1.24 | 77.25,23.5 TB6612.GND1 | 77.25,31 R12.2 | LED_ON.K 97,6.75 98.75,8.5 98.75,12.25 97,14 RGB.3 97,14.25 98.75,16 98.75,27.75 97.75,28.75 95.26,28.75 TB6612.GND2 | AE1.2 21.75,97 23.5,98.75 27.75,98.75 29.5,97 AE2.2 29.75,97 29.75,96.25 32.5,93.5 | 32.5,93.5 34,92 34,89 SHIFT4.8 34.25,88.75 37,86 39.5,86 43.75,81.75 | 43.75,81.75 44.25,81.25 SHIFT4.13 43.75,81.75 | 72.5,98.75 70.75,97 AE3.2 | 76.75,98.75 72.5,98.75 | 78.5,97 76.75,98.75 | 76.75,98.75 93.25,98.75 94.75,97.25 94.75,96.5 97,94.25 MIC.3 | 78.5,97 AE4.2 | 32.5,93.5 37.75,98.75 72.5,98.75
  Bottom 0.25: v43.75,68.5 43.75,67 | 43.75,81.75 v43.75,79.25 | 28.35,63.5 28.5,63.5 | SHIFT5.8 91.19,43.19 v92.5,44.5 | 43.75,67 42.75,66
  Bottom 0.6: 36,44.25 33.25,47 33.25,56.17 SHIFT1.8 | 41.75,67.25 40.5,67.25 36.75,63.5 30,63.5 | 28.5,63.5 29.85,63.5 | 64,31.5 70.75,31.5 71.25,31 R12.2 82.19,36 89,36 90,37 90,39 | 77.25,31 77.25,23.5 | TB6612.GND1 77.36,23.38 79.23,25.25 87.85,25.25 89.72,23.38 TB6612.GND2 | MUX1.GND 28.35,65 | 28.35,65 28.35,63.5 28.35,62 | 28.35,62 28.35,58.75 30,57 34.25,57 | 28.35,65 28.25,65 26.75,63.5 26.85,63.5 28.35,62 | 28.35,65 28.5,65 30,63.5 | 28.35,62 29.85,63.5 | 29.85,63.5 30,63.5
  Bottom 0.8: 26.75,12.75 24,12.75 | C1.2 59.75,18 63.75,14 | 36.25,23.75 37.5,23.75 38.75,25 | 51.25,18 45.5,23.75 40,23.75 38.75,25 | BAT.1 8,28 | 16,20 14,22 14,24 | 8,28 12,24 14,24 | 16.25,50.25 16.25,52.75 26.75,63.5 28.35,63.5 | 38.75,25 38.75,42.5 37.01,44.24 U$1.2 | CHARGER.OUT- 27.95,13.76 33,13.76 34,15 | U$1.14 35.24,13.76 34,15 | 34,15 34,23 | 34,23 34.92,23.92 U$1.10 | 8,28 16.19,36.19 BOOST.OUT- | 14,24 17,27 v20,27 | 34,23 30,27 v27,27
  pour Bottom: 0,100 100,100 100,0 0,0
  pour Top: 0,100 100,100 100,0 0,0
IR1_SEN
  Bottom 0.25: IR1.2 3,60.75 8.25,60.75 13,65.5 MUX1.C3
IR2_SEN  (via drill 0.4)
  Top 0.25: v88.25,54.25 v83.5,59
  Bottom 0.25: v83.5,59 84,59.5 84,72.75 86.75,75.5 MUX2.C8 | v88.25,54.25 97,54.25 IR4.3
IR3_SEN
  Bottom 0.25: IR3.3 3,54.25 4.25,54.25 13,63 MUX1.C2
IR4_SEN
  Bottom 0.25: IR2.2 97,60.5 91.75,60.5 88,56.75 85.75,56.75 85,57.5 85,71 86,72 88,72 88.75,72.75 88.75,76.5 87,78.25 MUX2.C7
IR_LED_DIR  (via drill 0.4)
  Top 0.25: v68.25,70 68.25,69 70.25,67 92.75,67 v95.5,64.25
  Bottom 0.25: v68.25,70 66,72.25 SHIFT3.15 | v95.5,64.25 96,64.25 97,63.25 IR2.3
IR_LED_ESQ  (via drill 0.4)
  Top 0.25: v8.5,66 8.5,68.5 12,72 14.5,72 23.75,81.25 23.75,84.5 27,87.75 v32.75,87.75
  Bottom 0.25: v8.5,66 5.75,63.25 3,63.25 IR1.3 | v32.75,87.75 32.75,87.25 38,82 38,76.25 41.75,72.5 SHIFT1.15
L1
  Bottom 0.25: SHIFT4.7 36.75,89 36.75,92 38.5,93.75 TAMPA.1
L2
  Bottom 0.25: SHIFT4.6 39.25,89 39.25,91.5 41,93.25 41,93.75 TAMPA.3
L3
  Bottom 0.25: SHIFT4.5 41.75,89 41.75,91.5 43.5,93.25 43.5,93.75 TAMPA.5
L4
  Bottom 0.25: SHIFT4.4 44.5,89 44.5,91.75 46,93.25 46,93.75 TAMPA.7
L5
  Bottom 0.25: SHIFT4.3 47,89 47,91.75 49,93.75 TAMPA.9
L6
  Bottom 0.25: SHIFT4.2 49.5,89 49.5,91.75 51.5,93.75 TAMPA.11
L7
  Bottom 0.25: SHIFT4.1 52,89 52,91.75 54,93.75 TAMPA.13
L8
  Bottom 0.25: SHIFT4.15 49.5,81.25 49.5,82.25 56.25,89 56.25,93.75 TAMPA.15
LATCH  (via drill 0.4)
  Top 0.25: v48.5,66 v40.5,66 40,66.5 40,75.5 v41.5,77 | v66.75,26.5 v66.75,52.75 70,56 72,56 74.7,53.3 v79.9,53.3 | v52.5,63.5 60.75,63.5 v62.75,61.5
  Bottom 0.25: v40.5,66 41.75,64.75 SHIFT1.12 | v48.5,66 50,64.75 52.5,64.75 | 52.5,64.75 53.75,64.75 SHIFT2.12 52.5,64.75 | v41.5,77 41.5,81 SHIFT4.12 | v66.75,26.5 64,26.5 U$1.22 | v66.75,52.75 66.75,53.25 62.75,57.25 v62.75,61.5 65.75,64.5 SHIFT3.12 | v52.5,63.5 52.5,64.75 | v79.9,53.3 82.27,50.93 SHIFT5.12
LD1  (via drill 0.4)
  Top 0.25: v62.25,78.5 v62.25,75 | v64.75,82 65.75,82 66.25,81.5 70,81.5 70.5,82 75,82 78.5,78.5 v84.75,78.5
  Bottom 0.25: v62.25,75 58.25,75 SHIFT3.1 | v62.25,78.5 62.25,79.5 v64.75,82 | v84.75,78.5 86,79.75 89.75,79.75 92.5,82.5 93.75,82.5 DIREITA.12
LD2  (via drill 0.4)
  Top 0.25: v63.5,78.5 v63.5,75 | v66.5,82.5 68.25,82.5 70.25,84.5 77,84.5 77.25,84.25 83.5,84.25 85.75,82 91.25,82 92,81.25 94.5,81.25 v95,80.75
  Bottom 0.25: v63.5,75 61,72.5 58.25,72.5 SHIFT3.2 | v63.5,78.5 63.5,79.5 v66.5,82.5 | v95,80.75 94.5,80.75 94,80.25 DIREITA.10
LD3  (via drill 0.4)
  Top 0.25: v56,70 56,76.75 v57,77.75 | v61.25,82 61.25,84.75 64.5,88 80,88 v82.25,85.75 | v89.75,81 92,78.75 94.5,78.75 v95,78.25
  Bottom 0.25: v56,70 58,70 SHIFT3.3 | v61.25,82 v57,77.75 | v82.25,85.75 86,82 88.75,82 v89.75,81 | v95,78.25 94.5,78.25 94,77.75 DIREITA.8
LD4  (via drill 0.4)
  Top 0.25: v73.75,65 68,65 67,66 64.74,66 64,66.74 64,68.5 v62.25,70.25 | v82.5,73.75 85.75,77 91.25,77 92.25,76 v95,76
  Bottom 0.25: v82.5,73.75 v73.75,65 | v95,76 94,75 DIREITA.6 | SHIFT3.4 61.17,70.25 v62.25,70.25
LD5  (via drill 0.4)
  Top 0.25: v82.5,71.25 85.5,74.25 91.5,74.25 92.25,73.5 v95,73.5 | v61,64.5 63.7,64.5 64.51,63.7 74.56,63.7 v74.75,63.5
  Bottom 0.25: v61,64.5 58.25,64.5 SHIFT3.5 | v82.5,71.25 v74.75,63.5 | v95,73.5 94,72.5 DIREITA.4
LD6  (via drill 0.4)
  Top 0.25: v68.25,66 75.75,66 78.5,63.25 84.75,63.25 86,64.5 v89.5,64.5
  Bottom 0.25: v89.5,64.5 89.5,65 93.75,69.25 DIREITA.2 | SHIFT3.6 58.25,62.25 62.25,62.25 64.11,64.11 64.11,65.16 64.95,66 v68.25,66
LDR1  (via drill 0.4)
  Top 0.25: v12.75,56.5 v12.75,44.5
  Bottom 0.25: LDR_ESQ.2 3,34.75 v12.75,44.5 | v12.75,56.5 12.75,57.5 13,57.75 MUX1.C0
LDR2  (via drill 0.4)
  Top 0.25: v93.5,37.25 93.5,42.25 v88,47.75
  Bottom 0.25: v93.5,37.25 97,33.75 LDR_DIR.2 | v88,47.75 86,49.75 86,52.75 84.5,54.25 84.5,71.25 86.25,73 86.75,73 MUX2.C9
LE1
  Bottom 0.25: ESQUERDA.12 3.75,82.5 4.75,82.5 6,81.25 10.5,81.25 12.25,79.5 19.25,79.5 26.5,72.25 26.5,70.25 27.25,69.5 29.5,69.5 32.25,72.25 32.25,73 34,74.75 SHIFT1.1
LE2  (via drill 0.4)
  Top 0.25: v25.5,72 31.75,72 v32.5,71.25
  Bottom 0.25: v25.5,72 20.5,77 12.25,77 10.5,78.75 6,78.75 4.75,80 3.75,80 ESQUERDA.10 | v32.5,71.25 33,71.25 34,72.25 SHIFT1.2
LE3  (via drill 0.4)
  Top 0.25: v22,74.25 26.75,69.5 v32,69.5
  Bottom 0.25: v22,74.25 12.25,74.25 10.25,76.25 6,76.25 4.75,77.5 3.75,77.5 ESQUERDA.8 | v32,69.5 33.75,69.5 34,69.75 SHIFT1.3
LE4  (via drill 0.4)
  Top 0.25: v21,71.75 26.75,66 v32.75,66
  Bottom 0.25: v21,71.75 12.25,71.75 10.25,73.75 6,73.75 4.75,75 3.75,75 ESQUERDA.6 | v32.75,66 34,67.25 SHIFT1.4
LE5  (via drill 0.4)
  Top 0.25: v26.25,67.75 27,67 v30.5,67
  Bottom 0.25: v26.25,67.75 24.75,69.25 12.25,69.25 10.25,71.25 6,71.25 4.75,72.5 3.75,72.5 ESQUERDA.4 | v30.5,67 32.75,64.75 34,64.75 SHIFT1.5
LE6  (via drill 0.4)
  Top 0.25: v23.75,67 24.25,67 26.25,65 29.5,65 v32,62.5
  Bottom 0.25: ESQUERDA.2 4.5,70 7.5,67 v23.75,67 | v32,62.5 33.75,62.5 34,62.25 SHIFT1.6
MIC
  Bottom 0.25: MUX2.C0 87,96 88,96 91,93 98.25,93 98.75,93.5 98.75,94.75 97,96.5 MIC.4
N$1
  Bottom 0.25: R4.1 81,9.25 81.75,9.25 87.5,15 95.5,15 97,16.5 RGB.4
N$2
  Bottom 0.25: R5.1 84,9.25 84.75,9.25 87,11.5 97,11.5 RGB.2
N$3
  Bottom 0.25: RGB.1 95,11 89.5,11 87.75,9.25 87,9.25 R6.1
N$4  (via drill 0.4)
  Top 0.25: v41.75,39 40.25,40.5 20.5,40.5 20.25,40.75 v4.5,40.75
  Bottom 0.25: SETA_ESQ.2 3,40 3.75,40.75 4,40.75 | v41.75,39 R11.1 | v4.5,40.75 4,40.75 | 4,40.75 3,41.75 SETA_ESQ.3
N$5  (via drill 0.4)
  Top 0.25: v43.25,55.75 47.25,55.75 48.25,56.75 48.25,61 52,64.75 v52,68.25
  Bottom 0.25: v43.25,55.75 42,57 SHIFT1.9 | v52,68.25 53.75,70 SHIFT2.14
N$6  (via drill 0.4)
  Top 0.25: v5,89.5 5,68.25 11.5,61.75 v31.25,61.75
  Bottom 0.25: FAROL_FRENTE.3 FAROL_FRENTE.2 3,91.5 v5,89.5 | FAROL_TRAS.3 FAROL_TRAS.2 82.5,3 79.75,5.75 79.75,9.75 78.5,11 75.5,11 69,17.5 63,17.5 50,30.5 50,44.5 47.5,47 R9.1 46,47 46,50 35.25,60.75 33.5,60.75 33,61.25 31.75,61.25 v31.25,61.75
N$7
  Bottom 0.25: R12.1 86,31 96,41 | SETA_DIR.3 97,42 96,41 | 96,41 97,40 SETA_DIR.2
N$8
  Bottom 0.8: 3,15.75 CHAVE.1 5.5,20.5 8,20.5 AMP2.2 | 3,15.75 3,11.5 CHAVE_PLACA.1 | 3,15.75 8,15.75 AMP1.2
N$9
  Bottom 0.25: BC337.2 R13.2
N$10  (via drill 0.4)
  Top 0.25: v78,85.75 76.25,87.5 65.8,87.5 v62.3,84
  Bottom 0.25: v62.3,84 BUZZER.- | v78,85.75 78,85.25 80.25,83 BC337.3
N$28
  Bottom 0.25: R7.1 90,9 90.75,9 97,2.75 LED_ON.A
N$29
  Bottom 0.25: SHIFT5.14 75.25,52.75 74.25,52.75 73.5,52 73.5,50 72.5,49 71.75,49 66,54.75 66,57 SHIFT3.9
N$30  (via drill 0.4)
  Top 0.25: v32.25,83 32.75,83 33.25,83.5 49.5,83.5 50.75,82.25 50.75,79.75 51.75,78.75 57.25,78.75 v63.75,72.25
  Bottom 0.25: v32.25,83 34,81.25 SHIFT4.9 | v63.75,72.25 66,70 SHIFT3.14
N$31  (via drill 0.4)
  Top 0.25: v51,66 48.25,68.75 44.75,68.75 44.25,69.25 44.25,76.5 v44.75,77
  Bottom 0.25: v51,66 54.75,66 55.75,65 55.75,59 54,57.25 SHIFT2.9 | v44.75,77 44.75,79 46.75,81 SHIFT4.14
N$39  (via drill 0.4)
  Top 0.25: v65.75,25 v65.75,40.25
  Bottom 0.25: 73.75,17 75,17 R2.1 | 73.75,17 72,17 R1.2 | v65.75,40.25 64.5,41.5 64,41.5 U$1.28 | 73.75,17 v65.75,25
PWMA
  Bottom 0.25: U$1.26 64,36.75 70,36.75 72,38.75 TB6612.PWMA
PWMB  (via drill 0.4)
  Top 0.25: v66,23.5 66.75,23.5 72.5,29.25 v72.5,32
  Bottom 0.25: v66,23.5 64,21.5 U$1.20 | v72.5,32 76,32 81,37 85.5,37 87.25,38.75 TB6612.PWMB
RGB_B  (via drill 0.4)
  Top 0.25: v71.5,33 v71.5,30
  Bottom 0.25: v71.5,30 75.75,25.75 75.75,22.5 78,20.25 79.75,20.25 82.25,17.75 82.25,16.25 83.5,15 84.5,15 86.25,16.75 87,16.75 R6.2 | v71.5,33 71.5,36 73.5,38 73.5,42 74.5,43 SHIFT5.2
RGB_G  (via drill 0.4)
  Top 0.25: v79.75,21.25 76.75,21.25 75.75,22.25 75.75,30 71,34.75 v71,41.5
  Bottom 0.25: v79.75,21.25 84,17 R5.2 | v71,41.5 71,42 72,43 SHIFT5.1
RGB_R  (via drill 0.4)
  Top 0.25: v79.75,18.25 80.5,19 91.5,19 95.75,23.25 98.25,23.25 98.75,23.75 98.75,28.25 98,29 93.25,29 87,35.25 75.75,35.25 73.25,37.75 73.25,44.5 v72.25,45.5
  Bottom 0.25: v79.75,18.25 81,17 R4.2 | v72.25,45.5 70,45.5 69,46.5 66,46.5 65,45.5 63,45.5 62.25,46.25 62.25,47.25 63,48 68.5,48 69,47.5 71.75,47.5 74.5,50.25 74.5,50.75 SHIFT5.15
S0  (via drill 0.4)
  Top 0.25: v49.75,71 49.75,73.25 v53,76.5 | v31,85.5 31.5,85 52.5,85 v55,82.5
  Bottom 0.25: v49.75,71 46.25,67.5 SHIFT2.4 | 55,76.5 68.75,76.5 71,74.25 72.75,74.25 73.5,73.5 73.5,72.5 MUX2.S3 | 55,76.5 v53,76.5 | v31,85.5 30.25,84.75 27.5,84.75 26.5,83.75 26.5,77.5 28.25,75.75 MUX1.S0 | 55,76.5 v55,82.5
S1  (via drill 0.4)
  Top 0.25: v30.75,79.75 30.75,80.25 33.5,83 47.5,83 48,82.5 v48,71.5 | v69,73 67.25,71.25 v60,71.25
  Bottom 0.25: v30.75,79.75 29.5,78.5 28.5,78.5 MUX1.S1 | SHIFT2.3 46.25,69.75 v48,71.5 48.5,72 50,72 50.75,71.25 v60,71.25 | v69,73 71.5,73 MUX2.S2
S2  (via drill 0.4)
  Top 0.25: v38.25,73.75 35,77 | 35,77 v33.25,78.75 | v67.25,80 56.25,80 51.75,84.5 27,84.5 26.5,84 26.5,77.75 27.25,77 35,77
  Bottom 0.25: v33.25,78.75 31.25,80.75 28.5,80.75 MUX1.S2 | v38.25,73.75 40.75,71.25 45,71.25 46,72.25 SHIFT2.2 | v67.25,80 71.5,75.75 MUX2.S1
S3  (via drill 0.4)
  Top 0.25: v30.5,83.5 31,84 51.5,84 53.25,82.25 v53.25,80.25 54,79.5 63.75,79.5 64.25,79 v69.5,79
  Bottom 0.25: v53.25,80.25 48,75 46.25,75 SHIFT2.1 | v30.5,83.5 28.5,83.5 MUX1.S3 | v69.5,79 70,78.5 71.5,78.5 MUX2.S0
SETA_DIR  (via drill 0.4)
  Top 0.25: v86,48.5 v69.25,48.5
  Bottom 0.25: SETA_DIR.1 98.75,38.75 98.75,42.75 97,44.5 SETA_DIR.4 95.88,43.5 95,43.5 92,46.5 88,46.5 v86,48.5 | v69.25,48.5 58.25,59.5 SHIFT3.7
SETA_ESQ  (via drill 0.4)
  Top 0.25: v32,60.25 29.75,60.25 13,43.5 v7,43.5
  Bottom 0.25: SETA_ESQ.1 5.5,39.5 5.5,42 | 5.5,42 3,44.5 SETA_ESQ.4 | v32,60.25 32.5,59.75 34,59.75 SHIFT1.7 | 5.5,42 v7,43.5
STBY
  Bottom 0.25: TB6612.STBY 79.75,39 79.75,40.5 82.25,43 SHIFT5.5
T1  (via drill 0.4)
  Top 0.25: v29.25,89 31.75,89 33.5,90.75 43.75,90.75 45,92 v45,95.25
  Bottom 0.25: v29.25,89 23.75,83.5 13.25,83.5 MUX1.C10 | v45,95.25 46,96.25 TAMPA.8
T2  (via drill 0.4)
  Top 0.25: v28,89 30.25,91.25 41.75,91.25 42.5,92 v42.5,95.25
  Bottom 0.25: v28,89 25,86 13.25,86 MUX1.C11 | v42.5,95.25 43.5,96.25 TAMPA.6
T3  (via drill 0.4)
  Top 0.25: v26.25,88.5 30.75,93 v36.25,93
  Bottom 0.25: v26.25,88.5 13.25,88.5 MUX1.C12 | v36.25,93 38.5,95.25 40,95.25 41,96.25 TAMPA.4
T4  (via drill 0.4)
  Top 0.25: v27.25,91 28,91 31,94 v35.75,94
  Bottom 0.25: v27.25,91 13.25,91 MUX1.C13 | v35.75,94 36.25,94 38.5,96.25 TAMPA.2
T5  (via drill 0.4)
  Top 0.25: v65.25,96.25 69.25,92.25 69.5,92.25 73.25,88.5 v84.75,88.5
  Bottom 0.25: v65.25,96.25 61.5,96.25 TAMPA.20 | v84.75,88.5 86.75,88.5 MUX2.C3
T6  (via drill 0.4)
  Top 0.25: v66.5,96.25 67,95.75 67,95.5 70.25,92.25 v79.75,92.25
  Bottom 0.25: v66.5,96.25 65.5,95.25 61,95.25 60,96.25 59,96.25 TAMPA.18 | v79.75,92.25 86,86 86.75,86 MUX2.C4
T7  (via drill 0.4)
  Top 0.25: v68.75,86.5 69.75,86.5 70.25,87 75.5,87 77.75,84.75 v85.25,84.75
  Bottom 0.25: v68.75,86.5 63.25,86.5 57.75,92 57.75,94 56.5,95.25 56.5,96.25 TAMPA.16 | v85.25,84.75 86.75,83.25 MUX2.C5
T8  (via drill 0.4)
  Top 0.25: v55.25,95 59.5,95 60.25,94.25 60.25,92 61,91.25 v69.25,91.25 | v75.75,91.25 76.25,91.25 v78,89.5
  Bottom 0.25: v55.25,95 54,96.25 TAMPA.14 | v75.75,91.25 v69.25,91.25 | v78,89.5 78,88.75 85.75,81 86.75,81 MUX2.C6
TD1
  Bottom 0.25: MUX2.C15 87,58 96.25,67.25 96.25,70 DIREITA.1
TD2
  Bottom 0.25: MUX2.C14 87,60.5 95.25,68.75 95.25,71.5 96.25,72.5 DIREITA.3
TD3
  Bottom 0.25: MUX2.C13 87,63.25 91.25,67.5 91.25,73 92.25,74 94.25,74 95.25,75 96.25,75 DIREITA.5
TD4
  Bottom 0.25: MUX2.C12 87,65.75 90.75,69.5 90.75,75 92.25,76.5 94.25,76.5 95,77.25 96,77.25 96.25,77.5 DIREITA.7
TD5
  Bottom 0.25: MUX2.C11 87,68.25 90.25,71.5 90.25,77 92.25,79 94.5,79 95.5,80 96.25,80 DIREITA.9
TD6
  Bottom 0.25: MUX2.C10 87,70.75 87.5,70.75 89.75,73 89.75,79 92.25,81.5 94.5,81.5 95.5,82.5 96.25,82.5 DIREITA.11
TE1
  Bottom 0.25: ESQUERDA.11 6.25,82.5 11.5,82.5 13,81 MUX1.C9
TE2
  Bottom 0.25: ESQUERDA.9 6.25,80 11,80 12.5,78.5 13,78.5 MUX1.C8
TE3
  Bottom 0.25: ESQUERDA.7 6.25,77.5 11,77.5 13,75.5 MUX1.C7
TE4
  Bottom 0.25: ESQUERDA.5 6.25,75 10.75,75 12.5,73.25 13,73.25 MUX1.C6
TE5
  Bottom 0.25: ESQUERDA.3 6.25,72.5 10.75,72.5 12.5,70.75 13,70.75 MUX1.C5
TE6
  Bottom 0.25: ESQUERDA.1 10.75,70 12.5,68.25 13,68.25 MUX1.C4
TRIG  (via drill 0.4)
  Top 0.25: v64,9.75 63,9.75 62.25,10.5 62.25,42.5 62.5,42.75 v65.75,42.75
  Bottom 0.25: v64,9.75 70.75,3 HCSR-04.3 | v65.75,42.75 65.75,41.5 66.75,40.5 66.75,40 66,39.25 64,39.25 U$1.27
VAMP
  Bottom 0.8: AMP2.1 9.25,18 10,17.25 10,14 9,13 AMP1.1 8.75,13.25 11.25,10.75 14.5,10.75 16,12.25 16,12.75 CHARGER.B+

### Text on the board
Bottom: TAMPI - 12/20
tPlace: TAMPI v1.0